# EAGLE design mcremote (EAGLE 9.2.2)
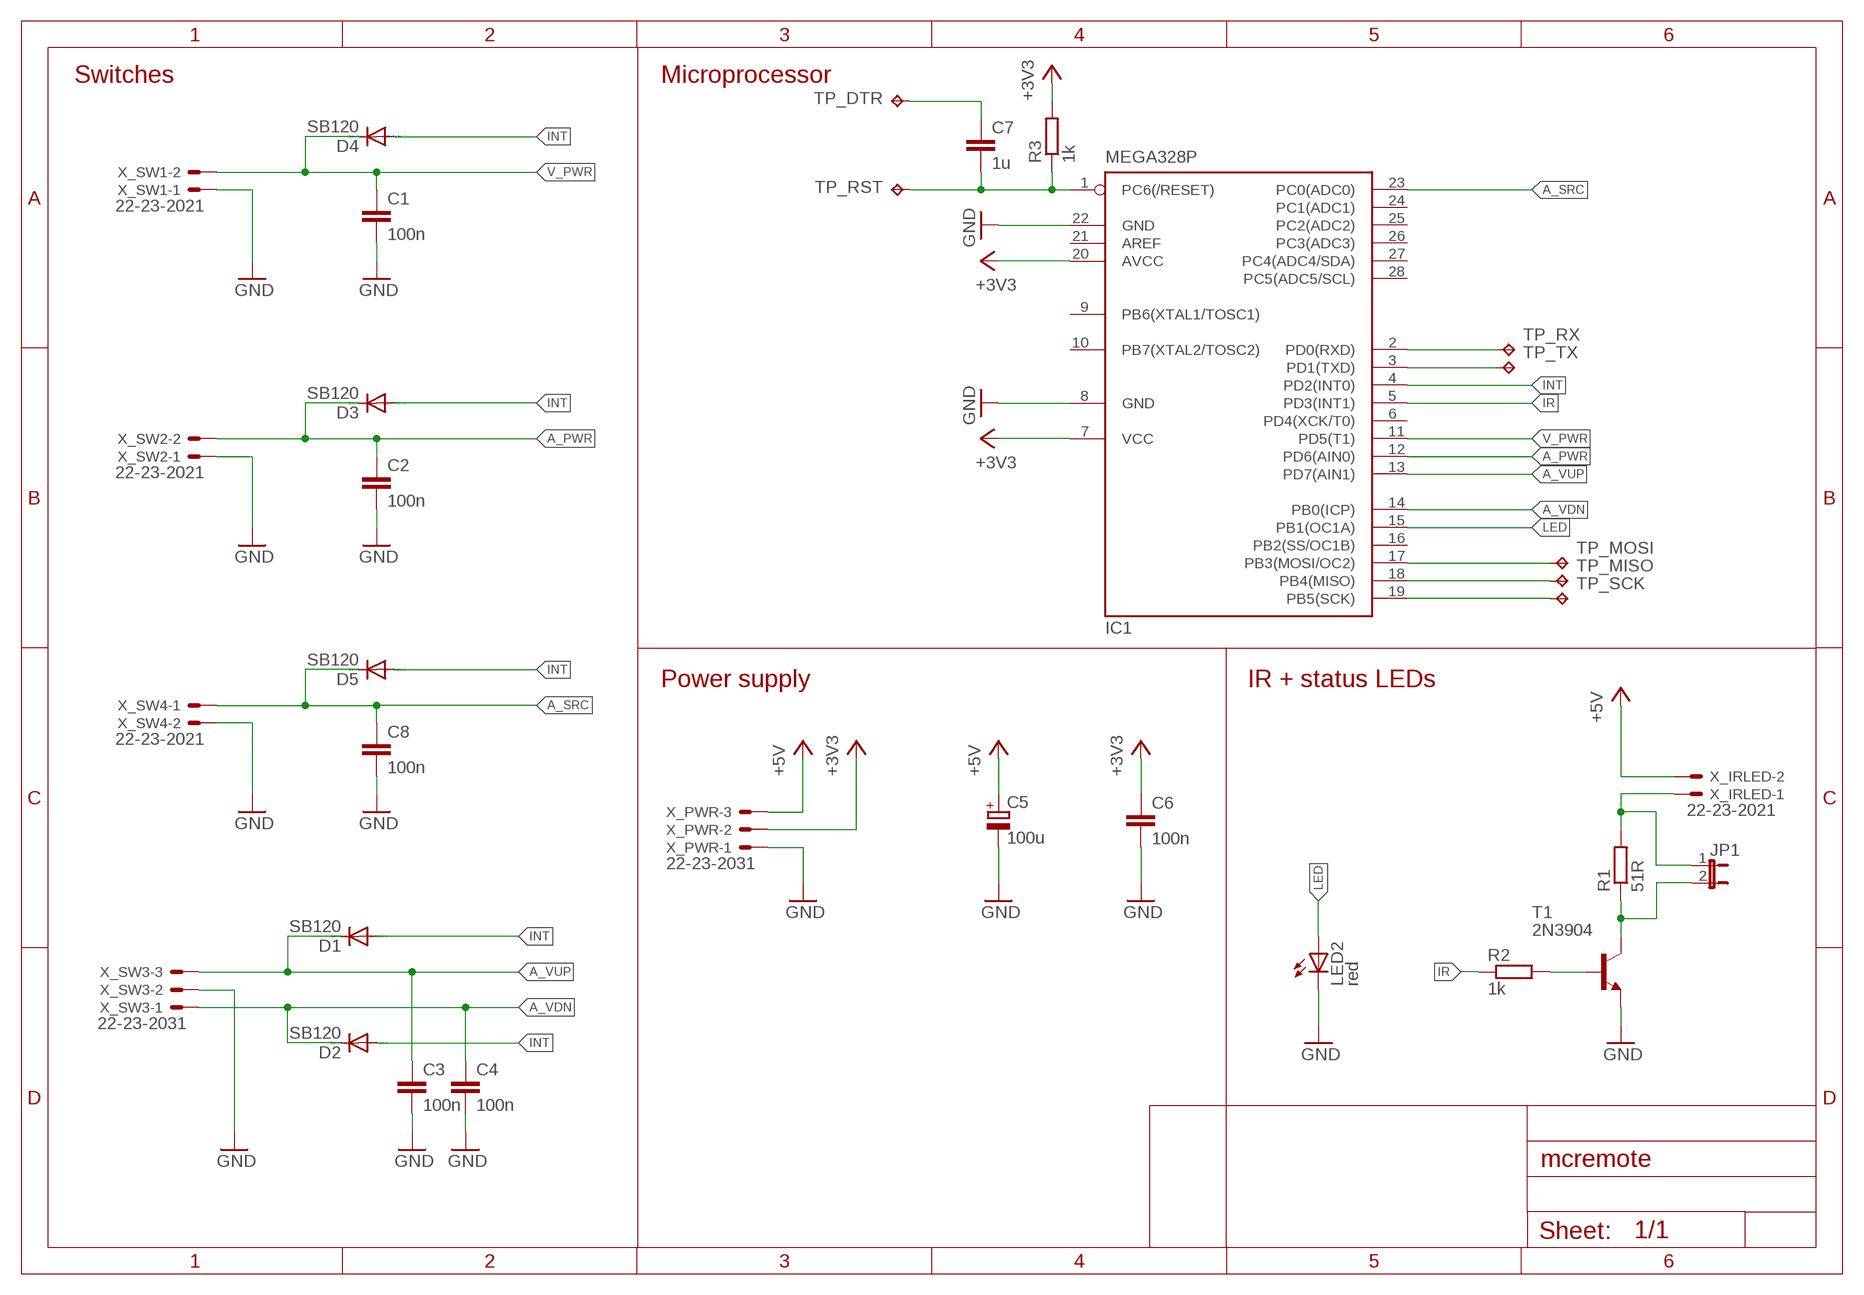
[diagram p0: schematic, sheet 1]

## Parts
C1  100n  C-EU025-024X044  [C025-024X044]
C2  100n  C-EU025-024X044  [C025-024X044]
C3  100n  C-EU025-024X044  [C025-024X044]
C4  100n  C-EU025-024X044  [C025-024X044]
C5  100u  CPOL-EUE3.5-8  [E3,5-8]
C6  100n  C-EU025-024X044  [C025-024X044]
C7  1u  C-EU025-024X044  [C025-024X044]
C8  100n  C-EU025-024X044  [C025-024X044]
D1  SB120  [DO41-10]
D2  SB120  [DO41-10]
D3  SB120  [DO41-10]
D4  SB120  [DO41-10]
D5  SB120  DIODE-DO41-7.6  [DO41-7.6]
IC1  MEGA328P  MEGA8-P  [DIL28-3]
JP1  JP1E  [JP1]
LED2  red  LED3MM  [LED3MM]
R1  51R  R-EU_0207/7  [0207/7]
R2  1k  R-EU_0207/7  [0207/7]
R3  1k  R-EU_0207/7  [0207/7]
T1  2N3904  [TO92]
TP_DTR  TPPAD1-13  [P1-13]
TP_MISO  TPPAD1-13  [P1-13]
TP_MOSI  TPPAD1-13  [P1-13]
TP_RST  TPPAD1-13  [P1-13]
TP_RX  TPPAD1-13  [P1-13]
TP_SCK  TPPAD1-13  [P1-13]
TP_TX  TPPAD1-13  [P1-13]
X_IRLED  22-23-2021  [22-23-2021]
X_PWR  22-23-2031  [22-23-2031]
X_SW1  22-23-2021  [22-23-2021]
X_SW2  22-23-2021  [22-23-2021]
X_SW3  22-23-2031  [22-23-2031]
X_SW4  22-23-2021  [22-23-2021]

## Nets
+3V3: C6.1 IC1.7(VCC) IC1.20(AVCC) R3.2 X_PWR.2
+6V: C5.+ X_IRLED.2 X_PWR.3 ; supply symbol labelled +5V
A_PWR: C2.1 D3.C IC1.12(PD6(AIN0)) X_SW2.2
A_SRC: C8.1 D5.C IC1.23(PC0(ADC0)) X_SW4.1
A_VDN: C4.1 D2.C IC1.14(PB0(ICP)) X_SW3.1
A_VUP: C3.1 D1.C IC1.13(PD7(AIN1)) X_SW3.3
GND: C1.2 C2.2 C3.2 C4.2 C5.- C6.2 C8.2 IC1.8(GND) IC1.22(GND) LED2.K(C) T1.3(E) X_PWR.1 X_SW1.1 X_SW2.1 X_SW3.2 X_SW4.2
INT: D1.A D2.A D3.A D4.A D5.A IC1.4(PD2(INT0))
IR: IC1.5(PD3(INT1)) R2.1
LED: IC1.15(PB1(OC1A)) LED2.A
MISO: IC1.18(PB4(MISO)) TP_MISO.TP
MOSI: IC1.17(PB3(MOSI/OC2)) TP_MOSI.TP
N$1: JP1.1 R1.2 X_IRLED.1
N$6: JP1.2 R1.1 T1.1(C)
N$7: R2.2 T1.2(B)
N$10: C7.2 IC1.1(PC6(/RESET)) R3.1 TP_RST.TP
N$13: C7.1 TP_DTR.TP
RX: IC1.2(PD0(RXD)) TP_RX.TP
SCK: IC1.19(PB5(SCK)) TP_SCK.TP
TX: IC1.3(PD1(TXD)) TP_TX.TP
V_PWR: C1.1 D4.C IC1.11(PD5(T1)) X_SW1.2
Unconnected: IC1.6(PD4(XCK/T0)) IC1.9(PB6(XTAL1/TOSC1)) IC1.10(PB7(XTAL2/TOSC2)) IC1.16(PB2(SS/OC1B)) IC1.21(AREF) IC1.24(PC1(ADC1)) IC1.25(PC2(ADC2)) IC1.26(PC3(ADC3)) IC1.27(PC4(ADC4/SDA)) IC1.28(PC5(ADC5/SCL))

## Notes on the sheet
- Switches | Microprocessor
- Power supply | IR + status LEDs

## Library data of the parts
C1-C4 C6-C8 = rcl:C-EU: CAPACITOR, European symbol; SPICEPREFIX: C
C5 = rcl:CPOL-EU: POLARIZED CAPACITOR, European symbol; SPICEPREFIX: C
D1-D4 = diode:SB120: DIODE barrier rectifier, 1 A (Fairchild)
D5 = diode:DIODE-: DIODE
IC1 = atmel:MEGA8-P: MICROCONTROLLER 8 Kbytes FLASH, 1 kbytes SRAM, 512 bytes EEPROM, USART, 4-channel 10 bit ADC, 2-channel 8 bit ADC Pin compatible with Atmega48, ATMega88, ATMega168 Source: avr.lbr; OC_FARNELL: unknown; OC_NEWARK: unknown
JP1 = jumper:JP1E: JUMPER
LED2 = led:LED: LED OSRAM: - CHIPLED LG R971, LG N971, LY N971, LG Q971, LY Q971, LO R971, LY R971 LH N974, LH R974 LS Q976, LO Q976, LY Q976 LO Q996 - Hyper CHIPLED LW Q18S LB Q993, LB Q99A, LB R99A - SideLED LS A670, LO A670, LY A670, LG A670, LP A670 LB A673, LV A673, LT A673, LW A673 LH A674 LY A675 LS A676, LA A676, LO A676, LY A676, LW A676 LS A679, LY A679, LG A679 - Hyper Micro SIDELED® LS Y876, LA Y876, LO Y876, LY Y876 LT Y87S - SmartLED LW L88C, LW L88S LB L89C, LB L89S, LG L890 LS L89K, LO L89K, LY L89K LS L896, LA L896, LO L896, LY L896 - TOPLED LS T670, LO T670, LY T670, LG T670, LP T670 LSG T670, LSP T670, LSY T670, LOP T670, LYG T670 LG T671, LOG T671, LSG T671 LB T673, LV T673, LT T673, LW T673 LH T674 LS T676, LA T676, LO T676, LY T676, LB T676, LH T676, LSB T676, LW T676 LB T67C, LV T67C, LT T67C, LS T67K, LO T67K, LY T67K, LW E67C LS E67B, LA E67B, LO E67B, LY E67B, LB E67C, LV E67C, LT E67C LW T67C LS T679, LY T679, LG T679 LS T770, LO T770, LY T770, LG T770, LP T770 LB T773, LV T773, LT T773, LW T773 LH T774 LS E675, LA E675, LY E675, LS T675 LS T776, LA T776, LO T776, LY T776, LB T776 LHGB T686 LT T68C, LB T68C - Hyper Mini TOPLED® LB M676 - Mini TOPLED Santana® LG M470 LS M47K, LO M47K, LY M47K Source: http://www.osram.convergy.de LUXEON: - LUMILED® LXK2-PW12-R00, LXK2-PW12-S00, LXK2-PW14-U00, LXK2-PW14-V00 LXK2-PM12-R00, LXK2-PM12-S00, LXK2-PM14-U00 LXK2-PE12-Q00, LXK2-PE12-R00, LXK2-PE12-S00, LXK2-PE14-T00, LXK2-PE14-U00 LXK2-PB12-K00, LXK2-PB12-L00, LXK2-PB12-M00, LXK2-PB14-N00, LXK2-PB14-P00, LXK2-PB14-Q00 LXK2-PR12-L00, LXK2-PR12-M00, LXK2-PR14-Q00, LXK2-PR14-R00 LXK2-PD12-Q00, LXK2-PD12-R00, LXK2-PD12-S00 LXK2-PH12-R00, LXK2-PH12-S00 LXK2-PL12-P00, LXK2-PL12-Q00, LXK2-PL12-R00 Source: www.luxeon.com KINGBRIGHT: KA-3528ASYC Source: www.kingbright.com
R1-R3 = rcl:R-EU_: RESISTOR, European symbol; SPICEPREFIX: R
T1 = transistor:2N3904: NPN TRANSISTOR
TP_DTR TP_MISO TP_MOSI TP_RST TP_RX TP_SCK TP_TX = testpad:TP: Test pad
X_IRLED X_SW1 X_SW2 X_SW4 = con-molex:22-23-2021: .100" (2.54mm) Center Header - 2 Pin; MF: MOLEX; MPN: 22-23-2021; OC_FARNELL: 1462926; OC_NEWARK: 25C3832
X_PWR X_SW3 = con-molex:22-23-2031: .100" (2.54mm) Center Header - 3 Pin; MF: MOLEX; MPN: 22-23-2031; OC_FARNELL: 1462950; OC_NEWARK: 30C0862

## Board
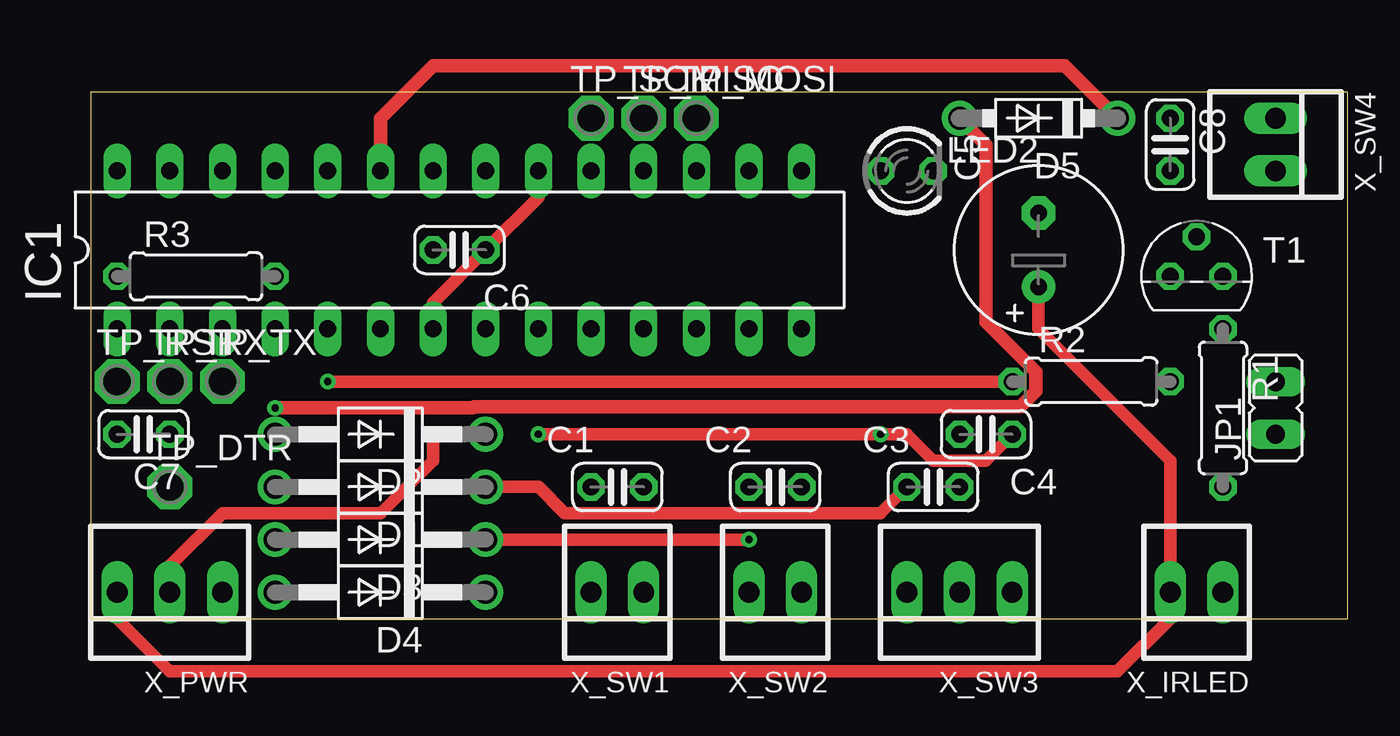
[diagram p1: board, top side]
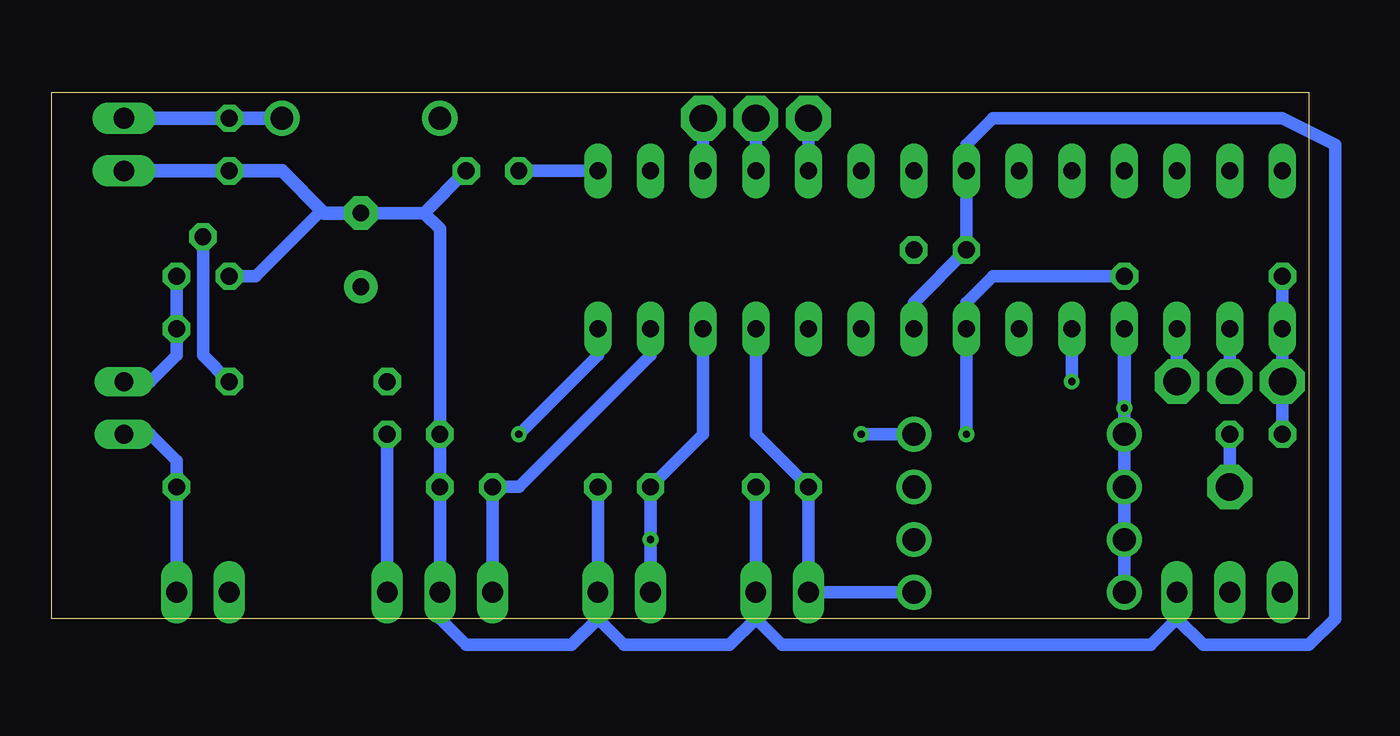
[diagram p2: board, bottom side, seen from below]

Size 60.63 x 25.39 mm. Coordinates in mm from the lower left corner, seen from the top.
Outline: 0,0 60.63,0 60.63,25.39 0,25.39 0,0
Copper layers (1*16): Top 0.035mm / dielectric 1.5mm / Bottom 0.035mm
Design rules "default": minimum track width 6mil, minimum drill 0.35mm, track to track 6mil, track to pad 6mil, pad to pad 6mil, via to via 6mil, smd to smd 6mil, copper to edge 40mil, drill to drill 6mil, minimum pad ring 10mil, minimum via ring 8mil, stop-mask expansion 4mil, vias tented up to drill 0mil, thermal gap 10mil

### Footprints (pad centres in the part's own frame; a part is rotated, then mirrored left to right if it is on the bottom)
C025-024X044 = drill 0.813 octagon: 1 -1.27,0; 2 1.27,0
E3,5-8 = drill 0.813 pad 1.6: + -1.778,0 | drill 0.813 pad 1.6 octagon: - 1.778,0
DO41-10 = drill 1.118: A 5.08,0; C -5.08,0
DO41-7.6 = drill 1.1 pad 1.7: A 3.81,0; C -3.81,0
DIL28-3 = drill 0.813 long: 1 -16.51,-3.81; 2 -13.97,-3.81; 3 -11.43,-3.81; 4 -8.89,-3.81; 5 -6.35,-3.81; 6 -3.81,-3.81; 7 -1.27,-3.81; 8 1.27,-3.81; 9 3.81,-3.81; 10 6.35,-3.81; 11 8.89,-3.81; 12 11.43,-3.81; 13 13.97,-3.81; 14 16.51,-3.81; 15 16.51,3.81; 16 13.97,3.81; 17 11.43,3.81; 18 8.89,3.81; 19 6.35,3.81; 20 3.81,3.81; 21 1.27,3.81; 22 -1.27,3.81; 23 -3.81,3.81; 24 -6.35,3.81; 25 -8.89,3.81; 26 -11.43,3.81; 27 -13.97,3.81; 28 -16.51,3.81
JP1 = drill 0.914 long: 1 0,-1.27; 2 0,1.27
LED3MM = drill 0.813 octagon: A -1.27,0; K 1.27,0
0207/7 = drill 0.813 octagon: 1 -3.81,0; 2 3.81,0
TO92 = drill 0.813 octagon: 1 1.27,0; 2 0,1.905; 3 -1.27,0
P1-13 = drill 1.321 pad 2.159 octagon: TP 0,0
22-23-2021 = drill 1 long: 1 -1.27,0; 2 1.27,0
22-23-2031 = drill 1 long: 1 -2.54,0; 2 0,0; 3 2.54,0

### Placement (x,y rotation side)
C1  25.4,6.35 0 top
C2  33.02,6.35 0 top
C3  40.64,6.35 0 top
C4  43.18,8.89 180 top
C5  45.72,17.78 90 top
C6  17.78,17.78 180 top
C7  2.54,8.89 180 top
C8  52.07,22.86 270 top
D1  13.97,6.35 180 top
D2  13.97,8.89 180 top
D3  13.97,3.81 180 top
D4  13.97,1.27 180 top
D5  45.72,24.13 180 top
IC1  17.78,17.78 0 top
JP1  57.15,10.16 0 top
LED2  39.37,21.59 0 top
R1  54.61,10.16 270 top
R2  48.26,11.43 0 top
R3  5.08,16.51 0 top
T1  53.34,16.51 0 top
TP_DTR  3.81,6.35 0 top
TP_MISO  26.67,24.13 0 top
TP_MOSI  29.21,24.13 0 top
TP_RST  1.27,11.43 0 top
TP_RX  3.81,11.43 0 top
TP_SCK  24.13,24.13 0 top
TP_TX  6.35,11.43 0 top
X_IRLED  53.34,1.27 180 top
X_PWR  3.81,1.27 180 top
X_SW1  25.4,1.27 180 top
X_SW2  33.02,1.27 180 top
X_SW3  41.91,1.27 180 top
X_SW4  57.15,22.86 270 top

### Tracks (layer width: path | path; a pad name or v marks a point on that pad's centre or on a via)
+3V3  (via drill 0.35)
  Top 0.61: IC1.7 16.51,15.24 C6.1 21.59,20.32 IC1.20 | X_PWR.2 3.81,2.54 6.35,5.08 13.97,5.08 16.51,7.62 v16.51,8.89
  Bottom 0.61: v16.51,8.89 IC1.7 16.51,15.24 15.24,16.51 R3.2
+6V
  Top 0.61: X_PWR.3 1.27,0 3.81,-2.54 49.53,-2.54 52.07,0 X_IRLED.2 52.07,7.62 45.72,13.97 C5.+
A_PWR  (via drill 0.35)
  Top 0.61: D3.C v31.75,3.81
  Bottom 0.61: X_SW2.2 v31.75,3.81 C2.1 29.21,8.89 IC1.12
A_SRC
  Top 0.66: D5.C 46.99,26.67 16.51,26.67 13.97,24.13 IC1.23
  Bottom 0.66: X_SW4.1 C8.1 D5.C
A_VDN  (via drill 0.35)
  Top 0.61: v21.59,8.89 v38.1,8.89 39.37,8.89 40.64,7.62 43.18,7.62 C4.1
  Bottom 0.61: X_SW3.1 C4.1 | D2.C v21.59,8.89 | IC1.14 34.29,12.7 v38.1,8.89
A_VUP
  Top 0.61: D1.C 21.59,6.35 22.86,5.08 38.1,5.08 C3.1
  Bottom 0.61: X_SW3.3 C3.1 38.1,6.35 31.75,12.7 IC1.13
GND
  Bottom 0.61: C1.2 X_SW1.1 26.67,0 | C2.2 X_SW2.1 34.29,0 | IC1.8 19.05,15.24 C6.2 IC1.22 16.51,22.86 15.24,24.13 1.27,24.13 -1.27,22.86 -1.27,0 0,-1.27 5.08,-1.27 6.35,0 | LED2.K 42.67,19.56 | 42.67,19.56 C5.- 47.75,19.56 50.8,16.51 T1.3 | 26.67,0 27.94,-1.27 33.02,-1.27 34.29,0 | 34.29,0 35.56,-1.27 40.64,-1.27 41.91,0 X_SW3.2 C3.2 C4.2 41.91,18.8 42.67,19.56 | X_PWR.1 6.35,0 | 6.35,0 7.62,-1.27 25.4,-1.27 26.67,0
  Bottom 0.66: X_SW4.2 C8.2 49.53,21.59 47.5,19.56 C5.-
INT  (via drill 0.35)
  Top 0.66: v8.89,10.16 18.45,10.16 18.5,10.21 44.85,10.21 45.59,10.96 45.59,11.9 44.92,12.57 43.18,14.32 43.18,22.86 D5.A
  Bottom 0.61: D4.A D3.A D1.A D2.A v8.89,10.16
  Bottom 0.66: v8.89,10.16 IC1.4
IR  (via drill 0.35)
  Top 0.61: v11.43,11.43 R2.1
  Bottom 0.61: IC1.5 v11.43,11.43
LED
  Bottom 0.61: IC1.15 LED2.A
MISO
  Bottom 0.61: TP_MISO.TP IC1.18
MOSI
  Bottom 0.61: TP_MOSI.TP IC1.17
N$1
  Bottom 0.61: X_IRLED.1 R1.2 54.61,7.62 55.88,8.89 JP1.1
N$6
  Bottom 0.61: T1.1 R1.1 54.61,12.7 55.88,11.43 JP1.2
N$7
  Bottom 0.61: T1.2 53.34,12.7 R2.2
N$10
  Bottom 0.61: C7.2 TP_RST.TP IC1.1 R3.1
N$13
  Bottom 0.61: C7.1 TP_DTR.TP
RX
  Bottom 0.61: IC1.2 TP_RX.TP
SCK
  Bottom 0.61: TP_SCK.TP IC1.19
TX
  Bottom 0.61: IC1.3 TP_TX.TP
V_PWR
  Bottom 0.61: D4.C X_SW1.2 C1.1 26.67,8.89 IC1.11